# Altium schematic sheet [03] - SCHEMATIC.SchDoc
size Letter; CheckedBy: Pablo M.; DocumentNumber: 3; Revision: v1; SheetNumber: 3; SheetTotal: 5
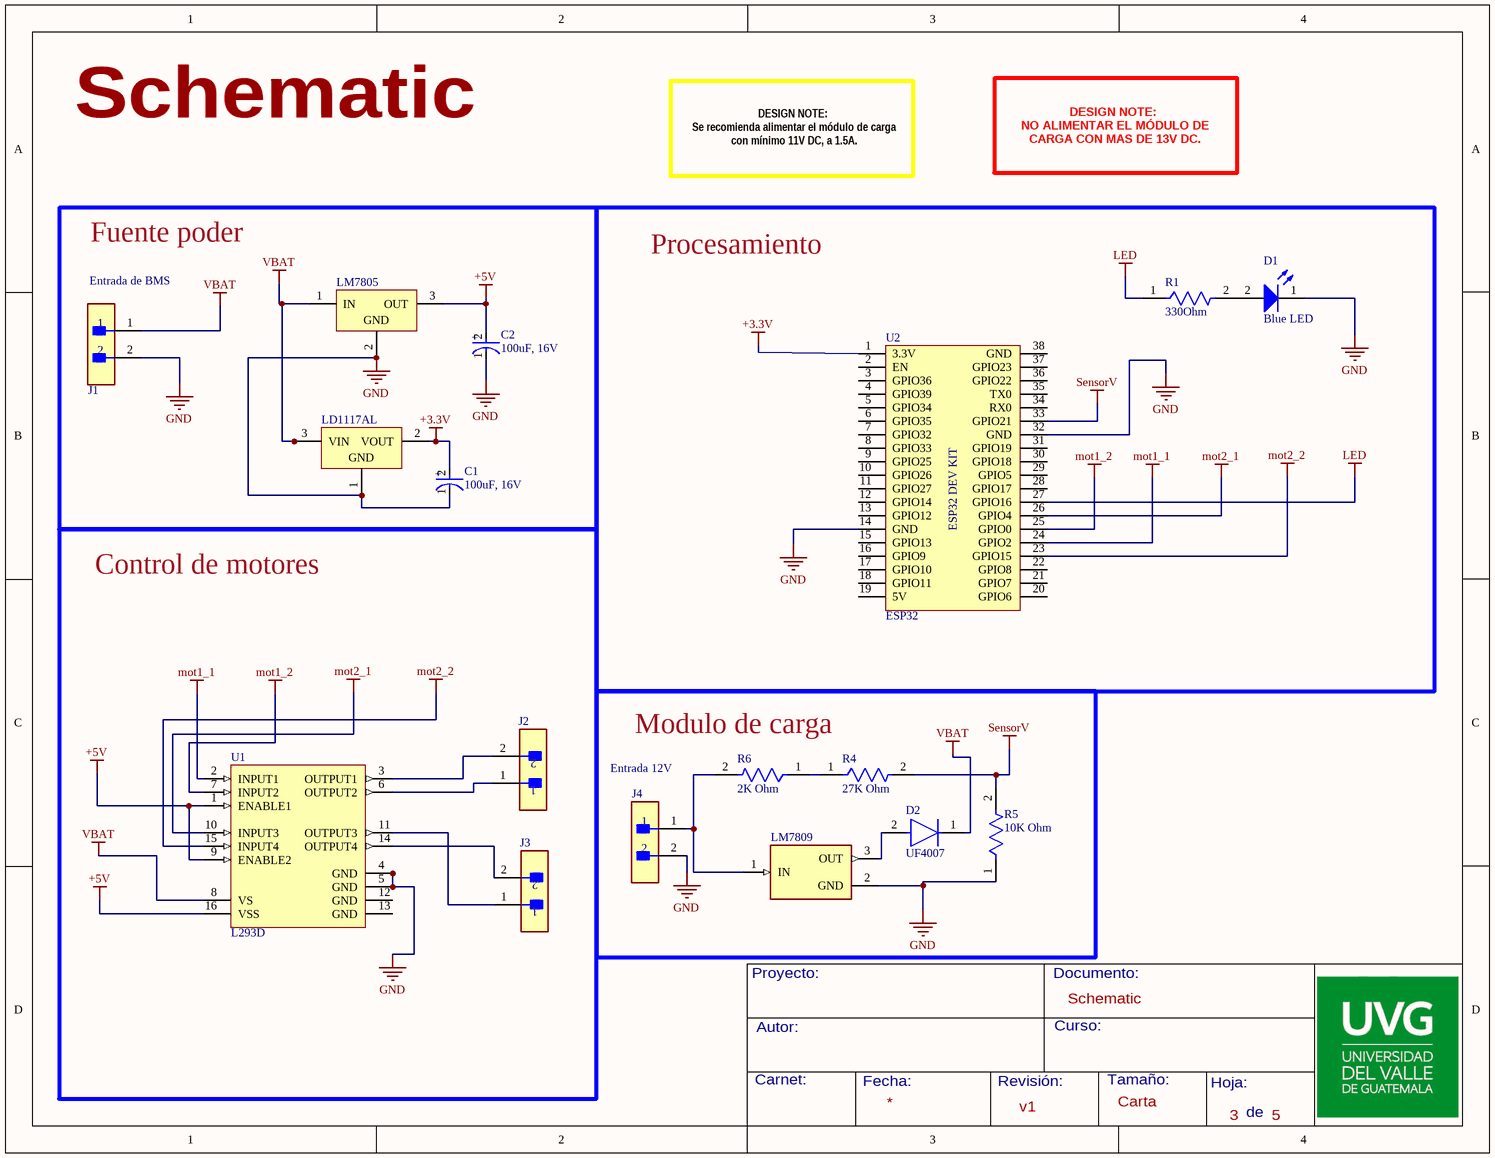
[diagram p0: [03] - SCHEMATIC.SchDoc]

## Parts
C1  100uF, 16V  [FP-RAD-TH-D_6_3_0_5-L_7_1-MFG]
C2  100uF, 16V  [FP-RAD-TH-D_6_3_0_5-L_7_1-MFG]
D1  Blue LED  [WL-TMRW_D3.9H10.5]
D2  UF4007  [FP-017AH-MFG]
J1  B2B-EH-A(LF)(SN)  [FP-B2B-EH-A_LF_SN-MFG]  (value not drawn)
J2  B2B-EH-A(LF)(SN)  [FP-B2B-EH-A_LF_SN-MFG]  (value not drawn)
J3  B2B-EH-A(LF)(SN)  [FP-B2B-EH-A_LF_SN-MFG]  (value not drawn)
J4  B2B-EH-A(LF)(SN)  [FP-B2B-EH-A_LF_SN-MFG]  (value not drawn)
LD1117AL  LD1117V33C  [TO220]  (value not drawn)
LM7805  LM7805  [TO220]  (value not drawn)
LM7809  LM7809CT  [TO254P470X1016X1879-3P]  (value not drawn)
R1  330Ohm  [FP-MRS25-MFG]
R4  27K Ohm  [FP-MRS25-MFG]
R5  10K Ohm  [FP-MRS25-MFG]
R6  2K Ohm  [FP-MRS25-MFG]
U1  L293D  [STM-L293D-16]
U2  ESP32  [ESP32 DEV KIT]

## Blocks framed on the sheet
Fuente poder: C1 C2 J1 LD1117AL LM7805
Procesamiento: D1 R1 U2
Control de motores: J2 J3 U1
Modulo de carga: D2 J4 LM7809 R4-R6

## Nets
+3.3V: C1.2(A) LD1117AL.2(VOUT) U2.1(3.3V)
+5V: C2.2(A) LM7805.3(OUT) U1.1(ENABLE1) U1.9(ENABLE2) U1.16(VSS)
GND: C1.1(C) C2.1(C) D1.1(K) J1.2 J4.2 LD1117AL.1(GND) LM7805.2(GND) LM7809.2(GND) R5.1 U1.4(GND) U1.5(GND) U2.14(GND) U2.32(GND)
LED: R1.1 U2.27(GPIO16)
mot1_1: U1.2(INPUT1) U2.24(GPIO2)
mot1_2: U1.7(INPUT2) U2.25(GPIO0)
mot2_1: U1.10(INPUT3) U2.26(GPIO4)
mot2_2: U1.15(INPUT4) U2.23(GPIO15)
SensorV: R4.2 R5.2 U2.33(GPIO21)
VBAT: D2.1(C) J1.1 LD1117AL.3(VIN) LM7805.1(IN) U1.8(VS)
NetD1_2: D1.2(A) R1.2
NetD2_2: D2.2(A) LM7809.3(OUT)
NetJ2_1: J2.1 U1.6(OUTPUT2)
NetJ2_2: J2.2 U1.3(OUTPUT1)
NetJ3_1: J3.1 U1.11(OUTPUT3)
NetJ3_2: J3.2 U1.14(OUTPUT4)
NetJ4_1: J4.1 LM7809.1(IN) R6.2
NetR4_1: R4.1 R6.1

Not connected (* = marked no-connect by the designer): U1 12(GND) 13(GND); U2 2(EN) 3(GPIO36) 4(GPIO39) 5(GPIO34) 6(GPIO35) 7(GPIO32) 8(GPIO33) 9(GPIO25) 10(GPIO26) 11(GPIO27) 12(GPIO14) 13(GPIO12) 15(GPIO13) 16(GPIO9) 17(GPIO10) 18(GPIO11) 19(5V) 20(GPIO6) 21(GPIO7) 22(GPIO8) 28(GPIO17) 29(GPIO5) 30(GPIO18) 31(GPIO19) 34(RX0) 35(TX0) 36(GPIO22) 37(GPIO23) 38(GND)

## Notes on the sheet
- Schematic
- DESIGN NOTE:
  Se recomienda alimentar el módulo de carga con mínimo 11V DC, a 1.5A.
- DESIGN NOTE:
  NO ALIMENTAR EL MÓDULO DE CARGA CON MAS DE 13V DC.
- (near J1) Entrada de BMS
- Entrada 12V
- Proyecto:
- Documento:
- Autor:
- Curso:
- Carnet:
- Fecha:
- Revisión:
- Tamaño:
- Carta
- Hoja:
- de
- (in symbol CMP-05427-001316-1) +
- (in symbol ESP32 Dev Module Kit) ESP32 DEV KIT

## Library data of the parts
C1 C2 = CMP-05427-001316-1: Aluminum Electrolytic Capacitors (Radial Lead Type) 100uF ±20% 16V; Life (Hours): 1000Hour; Lead Diameter: 0.45mm; Polarity: Polar; Ripple Current: 91mA; Series: KA; Packaging: Tape and Reel; Voltage Rating: 16V; Voltage Rating (DC): 16V; Min Operating Temperature: -40°C; Lead Pitch: 2.5mm; Mount: Through Hole; Height - Seated (Max): 0.315inch; Package Quantity: 2000; Length: 7mm; Termination: Radial; Voltage: 16V; Diameter: 6.3mm; Height: 7mm; Radiation Hardening: No; RoHS Compliant: Yes; Tolerance: 20%; Capacitance: 100uF; Case/Package: Radial; Max Operating Temperature: 85°C
D1 = CMP-1489-00002-2: NexarPartId: 29717808; Lens Style: Circular, Clear, Round; Max Reverse Voltage (DC): 5V; Viewing Angle: 30°; Peak Wavelength: 465nm; Dominant Wavelength: 470nm; Luminous Intensity: 3.8cd; Forward Voltage: 2.8V; Lens Size: 3mm; Test Current: 20mA; Forward Current: 100mA; Min Operating Temperature: -40°C; Length: 3mm; Height: 5.3mm; Mount: Through Hole; Max Operating Temperature: 85°C; Case/Package: Radial; RoHS: Compliant; Color: Blue; REACH SVHC: Unknown; Packaging: Bulk; Width: 3mm; Wavelength: 470nm
D2 = CMP-2000-05028-2: DIODE GEN PURP 1KV 1A DO41; Manufacturer: ON Semiconductor; Capacitance: 17pF; Max Surge Forward Current: 30A; Max Repetitive Reverse Voltage: 1000V; Value: 17pF; Max Junction Temp: +150°C; Peak Reverse Current: 10uA; Temperature: -65°C to +150°C; ComponentLink2Description: Datasheet; Digikey Description: DIODE GEN PURP 1KV 1A DO41; Temperature Range High: +150°C; Height: 2.72mm; Category: Diode; Automotive: No; Package: 017AH; Device Class L1: Discrete Semiconductors; ComponentLink2URL: https://www.onsemi.com/pub/Collateral/UF4007-D.pdf; Device Class L3: Rectifier Diodes; Mouser Description: Rectifiers 1000V 1a Rectifier Glass Passivated; Temperature Range Low: -65°C; Octopart: https://octopart.com/uf4007-on+semiconductor-84331693; Manufacturer Part Number: UF4007; Forward Current: 1A; Device Class L2: Diodes; Lead Free: Yes; Footprint Url: https://www.onsemi.com/pub/Collateral/017AH.PDF; RoHS: TRUE
J1-J4 = CMP-17439-000026-1: CONN HEADER VERT 2POS 2.5MM; Number of Contacts: 2; Current Rating: 3A; Connector Type: Plug; Contact Resistance: 20mR; Gender: Male; Voltage Rating: 250V; Fastening Type: Detent; Depth: 3.8mm; Max Operating Temperature: 85°C; Orientation: Straight; Series: EH; Contact Plating: Tin; Min Operating Temperature: -25°C; Contact Type: Male Pin; Housing Color: White; Termination: Press-Fit; Housing Material: Nylon; Pitch: 2.5mm; Number of Positions: 2; Max Current Rating: 3A; Packaging: Bulk; Lead Free: Lead Free; Number of Rows: 1; Length: 7.5mm; Contact Mating Length: 0.13inch; Color: Natural; Max Voltage Rating (AC): 250V; Contact Material: Copper Alloy; Mount: Through Hole
LD1117AL = CMP-0244-00471-1: Fixed Low Drop Positive Voltage Regulator, 3.3V, 3-Pin TO-220; ComponentLink1URL: http://www.st.com; ComponentLink1Description: Manufacturer URL; PackageDescription: TO, Thru-Hole, Vertical, Heatsink Mounted; 3 In-Line Leads; Pitch 2.54 mm; ComponentLink2URL: http://www.st.com/internet/com/TECHNICAL_RESOURCES/TECHNICAL_LITERATURE/DATASHEET/CD00000544.pdf; PackageVersion: ver3.0; ComponentLink2Description: Datasheet; ComponentLink3URL: http://www.st.com/internet/com/TECHNICAL_RESOURCES/TECHNICAL_LITERATURE/PACKAGE_INFORMATION/CD00004649.pdf; ComponentLink3Description: Package Specification; PackageReference: TO220; DatasheetVersion: 1/11/2011
LM7805 = LM7805: Positive Voltage Regulator, 5V, 3-Pin TO-220; PackageDescription: TO, Thru-Hole, Vertical, Heatsink Mounted; 3 In-Line Leads; Pitch 2.54 mm; ComponentLink2Description: Datasheet; PackageReference: TO220; ComponentLink3URL: http://www.st.com/internet/com/TECHNICAL_RESOURCES/TECHNICAL_LITERATURE/PACKAGE_INFORMATION/CD00004649.pdf; DatasheetVersion: 16/11/2011; ComponentLink1Description: Manufacturer URL; ComponentLink1URL: http://www.st.com; PackageVersion: ver3.0; ComponentLink3Description: Package Specification; ComponentLink2URL: http://www.st.com/internet/com/TECHNICAL_RESOURCES/TECHNICAL_LITERATURE/DATASHEET/CD00000444.pdf
LM7809 = LM7809CT: Linear Voltage Regulator IC 1 Output 1A TO-220-3; MF: Fujitsu; MP: LM7809C; Price: None; SnapEDA_Link: https://www.snapeda.com/parts/LM7809C/Fujitsu/view-part/1233224/?ref=snap; Package: TO-220-3 Fujitsu; Value: *; Availability: Unavailable
R1 R4-R6 = CMP-02408-000049-1: RES 953 OHM 0.6W 1% AXIAL; Power Rating: 600mW; Voltage Rating: 350V; Resistance: 953R; Temperature Coefficient: 50ppm/°C; Lead Length: 26mm; Case/Package: Axial; Max Power Dissipation: 600mW; Series: MRS25; Resistance Tolerance: 1%; Packaging: Tape and Reel; Radiation Hardening: No; Min Operating Temperature: -55°C; Contact Plating: Tin; Max Operating Temperature: 155°C; Length: 6.5mm; Number of Terminations: 2; Width: 2.5mm; Construction: Cylindrical; Termination: Axial; RoHS Compliant: Yes; Lead Free: Lead Free; Military Standard: Not; Technology: THIN FILM; Diameter: 2.5mm; Tolerance: 1%; Resistor Type: Metal Film
U1 = CMP-2000-06524-1: Push-Pull Four Channel Driver with Diode, 4.5 to 36 V, -40 to 150 degC, 16-Pin PDIP, RoHS, Tube; Manufacturer: STMicroelectronics; Number of Outputs: 4; Current - Peak Output: 1.2A; Current - Output / Channel: 600mA; Input Type: Non-Inverting; Other Related Documents: L293DViewAllSpecifications; Dynamic Catalog: HalfBridge; Voltage - Supply: 4.5V~36V; Other Names: 497-2936-5; Package / Case: 16-DIP(0.300",7.62mm); PartNumber: L293D; Operating Temperature: -40°C~150°C; Datasheet URL: http://www.st.com/st-web-ui/static/active/en/resource/technical/document/datasheet/CD00000059.pdf; Supplier Device Package: 16-PowerDIP; Packaging: Tube; Package Description: 16-Pin Thru-Hole Dual-In-Line, Body 20 x 6.85 mm, Pitch 2.54 mm; Standard Package: 25; Datasheet Version: 07/2003; On-State Resistance: -; Manufacturer URL: http://www.st.com/; Category: IntegratedCircuits(ICs); Family: PMIC-MOSFET,BridgeDrivers-InternalSwitch; Type: HalfBridge; Series: -; Mounting Technology: ThroughHole; Package Reference: DIP-16; Mounting Type: ThroughHole
U2 = ESP32 Dev Module Kit: ESP32 Depelopment version 38 pines